# EAGLE design etch_a_sketc (EAGLE 9.6.2)
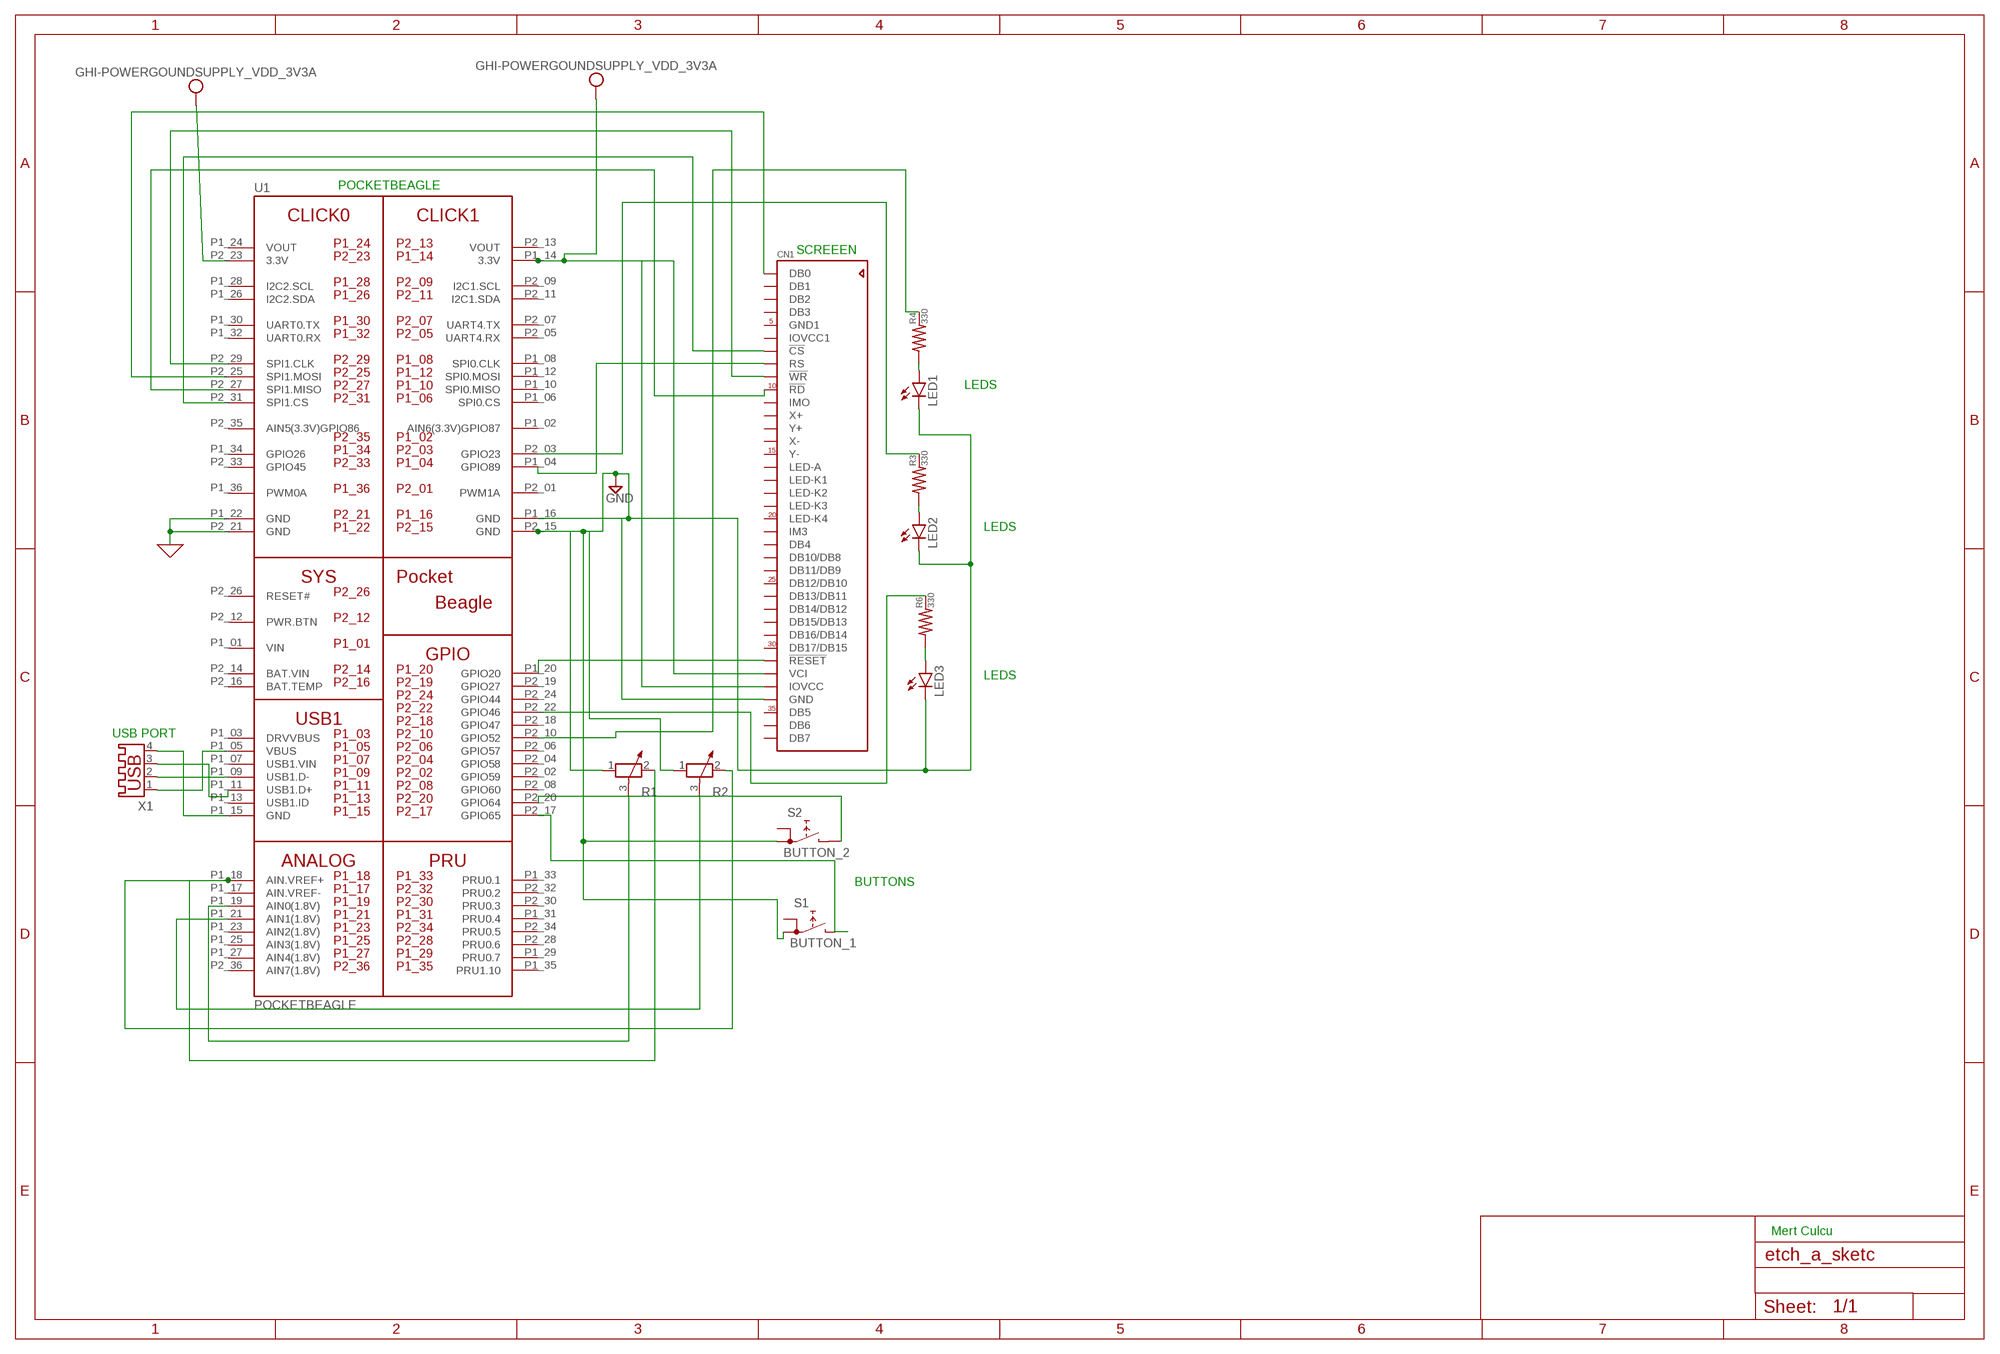
[diagram p0: schematic, sheet 1]

## Parts
CN1  ADAFRUIT_ILI9325_LCD1.0MM  [ADAFRUIT_ILI9325_28INCH_TS]
LED1  LED_BLUE5MM  [LED5MM]
LED2  LED_GREEN5MM  [LED5MM]
LED3  LED_RED5MM  [LED5MM]
R1  POTENTIOMETER_PT-10  [PT-10]
R2  POTENTIOMETER_2PT-10  [PT-10]
R3  330  GHI-BASICCOMPONENTS_RESISTOR-(INCH)-0402  [GHI-BASICCOMPONENTS_0402]
R4  330  GHI-BASICCOMPONENTS_RESISTOR-(INCH)-0402  [GHI-BASICCOMPONENTS_0402]
R6  330  GHI-BASICCOMPONENTS_RESISTOR-(INCH)-0402  [GHI-BASICCOMPONENTS_0402]
S1  BUTTON_1  [RDT1034]
S2  BUTTON_2  [RDT1034]
U1  POCKETBEAGLE  [POCKETBEAGLE]
X1  USB_CONNECTOR  [USB-A003]

## Nets
0: U1.P1_22(GND) U1.P2_21(GND) ; supply symbol labelled GND
GND: CN1.34(GND) LED1.K(C) LED2.K(C) LED3.K(C) R1.1 R2.1 S1.A1 S2.A1 U1.P1_16(GND) U1.P2_15(GND)
N$3: CN1.7(!CS) U1.P2_31(SPI1.CS)
N$4: CN1.8(RS) U1.P1_04(GPIO89)
N$5: CN1.9(!WR) U1.P2_29(SPI1.CLK)
N$6: CN1.10(!RD) U1.P2_27(SPI1.MISO)
N$7: CN1.1(DB0) U1.P2_25(SPI1.MOSI)
N$8: CN1.31(!RESET) U1.P1_20(GPIO20)
N$10: U1.P1_09(USB1.D-) X1.2
N$11: R1.2 R2.2 U1.P1_18(AIN.VREF+)
N$12: R1.3 U1.P1_19(AIN0(1.8V))
N$13: R2.3 U1.P1_21(AIN1(1.8V))
N$14: LED1.A R4.1
N$15: S2.B U1.P2_20(GPIO64)
N$16: S1.B U1.P2_17(GPIO65)
N$17: LED2.A R3.1
N$18: LED3.A R6.1
N$19: U1.P1_05(VBUS) X1.1
N$20: U1.P1_11(USB1.D+) X1.3
N$21: U1.P1_15(GND) X1.4
N$23: R6.2 U1.P2_22(GPIO46)
N$24: R3.2 U1.P2_03(GPIO23)
N$25: R4.2 U1.P2_10(GPIO52)
VDD_3V3A: CN1.32(VCI) CN1.33(IOVCC) U1.P1_14(3.3V) U1.P2_23(3.3V) ; supply symbol labelled GHI-POWERGOUNDSUPPLY_VDD_3V3A
Unconnected: CN1.2(DB1) CN1.3(DB2) CN1.4(DB3) CN1.11(IMO) CN1.12(X+) CN1.13(Y+) CN1.14(X-) CN1.15(Y-) CN1.16(LED-A) CN1.17(LED-K1) CN1.18(LED-K2) CN1.19(LED-K3) CN1.20(LED-K4) CN1.21(IM3) CN1.22(DB4) CN1.23(DB10/DB8) CN1.24(DB11/DB9) CN1.25(DB12/DB10) CN1.26(DB13/DB11) CN1.27(DB14/DB12) CN1.28(DB15/DB13) CN1.29(DB16/DB14) CN1.30(DB17/DB15) CN1.35(DB5) CN1.36(DB6) CN1.37(DB7) S1.A S2.A U1.P1_02(AIN6(3.3V)GPIO87) U1.P1_03(DRVVBUS) U1.P1_06(SPI0.CS) U1.P1_07(USB1.VIN) U1.P1_08(SPI0.CLK) U1.P1_10(SPI0.MISO) U1.P1_12(SPI0.MOSI) U1.P1_13(USB1.ID) U1.P1_17(AIN.VREF-) U1.P1_23(AIN2(1.8V)) U1.P1_25(AIN3(1.8V)) U1.P1_26(I2C2.SDA) U1.P1_27(AIN4(1.8V)) U1.P1_28(I2C2.SCL) U1.P1_29(PRU0.7) U1.P1_30(UART0.TX) U1.P1_31(PRU0.4) U1.P1_32(UART0.RX) U1.P1_33(PRU0.1) U1.P1_34(GPIO26) U1.P1_35(PRU1.10) U1.P1_36(PWM0A) U1.P2_01(PWM1A) U1.P2_02(GPIO59) U1.P2_04(GPIO58) U1.P2_05(UART4.RX) U1.P2_06(GPIO57) U1.P2_07(UART4.TX) U1.P2_08(GPIO60) U1.P2_09(I2C1.SCL) U1.P2_11(I2C1.SDA) U1.P2_12(PWR.BTN) U1.P2_16(BAT.TEMP) U1.P2_18(GPIO47) U1.P2_19(GPIO27) U1.P2_24(GPIO44) U1.P2_26(RESET#) U1.P2_28(PRU0.6) U1.P2_30(PRU0.3) U1.P2_32(PRU0.2) U1.P2_33(GPIO45) U1.P2_34(PRU0.5) U1.P2_35(AIN5(3.3V)GPIO86) U1.P2_36(AIN7(1.8V))

## Notes on the sheet
- POCKETBEAGLE
- SCREEEN
- LEDS
- LEDS
- LEDS
- USB PORT
- BUTTONS
- Mert Culcu

## Power pins joined to a net without a drawn wire
BAT.VIN: U1.P2_14(BAT.VIN)
GND1: CN1.5(GND1)
IOVCC1: CN1.6(IOVCC1)
VIN: U1.P1_01(VIN)
VOUT: U1.P1_24(VOUT) U1.P2_13(VOUT)

## Library data of the parts
CN1 = etch_a_sketch:ADAFRUIT_ILI9325_LCD: 2.8" ILI9325-based TFT LCD w/Integrated Touch Screen
LED1 = etch_a_sketch:LED_BLUE: LED OSRAM: - CHIPLED LG R971, LG N971, LY N971, LG Q971, LY Q971, LO R971, LY R971 LH N974, LH R974 LS Q976, LO Q976, LY Q976 LO Q996 - Hyper CHIPLED LW Q18S LB Q993, LB Q99A, LB R99A - SideLED LS A670, LO A670, LY A670, LG A670, LP A670 LB A673, LV A673, LT A673, LW A673 LH A674 LY A675 LS A676, LA A676, LO A676, LY A676, LW A676 LS A679, LY A679, LG A679 - Hyper Micro SIDELED® LS Y876, LA Y876, LO Y876, LY Y876 LT Y87S - SmartLED LW L88C, LW L88S LB L89C, LB L89S, LG L890 LS L89K, LO L89K, LY L89K LS L896, LA L896, LO L896, LY L896 - TOPLED LS T670, LO T670, LY T670, LG T670, LP T670 LSG T670, LSP T670, LSY T670, LOP T670, LYG T670 LG T671, LOG T671, LSG T671 LB T673, LV T673, LT T673, LW T673 LH T674 LS T676, LA T676, LO T676, LY T676, LB T676, LH T676, LSB T676, LW T676 LB T67C, LV T67C, LT T67C, LS T67K, LO T67K, LY T67K, LW E67C LS E67B, LA E67B, LO E67B, LY E67B, LB E67C, LV E67C, LT E67C LW T67C LS T679, LY T679, LG T679 LS T770, LO T770, LY T770, LG T770, LP T770 LB T773, LV T773, LT T773, LW T773 LH T774 LS E675, LA E675, LY E675, LS T675 LS T776, LA T776, LO T776, LY T776, LB T776 LHGB T686 LT T68C, LB T68C - Hyper Mini TOPLED® LB M676 - Mini TOPLED Santana® LG M470 LS M47K, LO M47K, LY M47K Source: http://www.osram.convergy.de LUXEON: - LUMILED® LXK2-PW12-R00, LXK2-PW12-S00, LXK2-PW14-U00, LXK2-PW14-V00 LXK2-PM12-R00, LXK2-PM12-S00, LXK2-PM14-U00 LXK2-PE12-Q00, LXK2-PE12-R00, LXK2-PE12-S00, LXK2-PE14-T00, LXK2-PE14-U00 LXK2-PB12-K00, LXK2-PB12-L00, LXK2-PB12-M00, LXK2-PB14-N00, LXK2-PB14-P00, LXK2-PB14-Q00 LXK2-PR12-L00, LXK2-PR12-M00, LXK2-PR14-Q00, LXK2-PR14-R00 LXK2-PD12-Q00, LXK2-PD12-R00, LXK2-PD12-S00 LXK2-PH12-R00, LXK2-PH12-S00 LXK2-PL12-P00, LXK2-PL12-Q00, LXK2-PL12-R00 Source: www.luxeon.com KINGBRIGHT: KA-3528ASYC Source: www.kingbright.com
LED2 = etch_a_sketch:LED_GREEN: LED OSRAM: - CHIPLED LG R971, LG N971, LY N971, LG Q971, LY Q971, LO R971, LY R971 LH N974, LH R974 LS Q976, LO Q976, LY Q976 LO Q996 - Hyper CHIPLED LW Q18S LB Q993, LB Q99A, LB R99A - SideLED LS A670, LO A670, LY A670, LG A670, LP A670 LB A673, LV A673, LT A673, LW A673 LH A674 LY A675 LS A676, LA A676, LO A676, LY A676, LW A676 LS A679, LY A679, LG A679 - Hyper Micro SIDELED® LS Y876, LA Y876, LO Y876, LY Y876 LT Y87S - SmartLED LW L88C, LW L88S LB L89C, LB L89S, LG L890 LS L89K, LO L89K, LY L89K LS L896, LA L896, LO L896, LY L896 - TOPLED LS T670, LO T670, LY T670, LG T670, LP T670 LSG T670, LSP T670, LSY T670, LOP T670, LYG T670 LG T671, LOG T671, LSG T671 LB T673, LV T673, LT T673, LW T673 LH T674 LS T676, LA T676, LO T676, LY T676, LB T676, LH T676, LSB T676, LW T676 LB T67C, LV T67C, LT T67C, LS T67K, LO T67K, LY T67K, LW E67C LS E67B, LA E67B, LO E67B, LY E67B, LB E67C, LV E67C, LT E67C LW T67C LS T679, LY T679, LG T679 LS T770, LO T770, LY T770, LG T770, LP T770 LB T773, LV T773, LT T773, LW T773 LH T774 LS E675, LA E675, LY E675, LS T675 LS T776, LA T776, LO T776, LY T776, LB T776 LHGB T686 LT T68C, LB T68C - Hyper Mini TOPLED® LB M676 - Mini TOPLED Santana® LG M470 LS M47K, LO M47K, LY M47K Source: http://www.osram.convergy.de LUXEON: - LUMILED® LXK2-PW12-R00, LXK2-PW12-S00, LXK2-PW14-U00, LXK2-PW14-V00 LXK2-PM12-R00, LXK2-PM12-S00, LXK2-PM14-U00 LXK2-PE12-Q00, LXK2-PE12-R00, LXK2-PE12-S00, LXK2-PE14-T00, LXK2-PE14-U00 LXK2-PB12-K00, LXK2-PB12-L00, LXK2-PB12-M00, LXK2-PB14-N00, LXK2-PB14-P00, LXK2-PB14-Q00 LXK2-PR12-L00, LXK2-PR12-M00, LXK2-PR14-Q00, LXK2-PR14-R00 LXK2-PD12-Q00, LXK2-PD12-R00, LXK2-PD12-S00 LXK2-PH12-R00, LXK2-PH12-S00 LXK2-PL12-P00, LXK2-PL12-Q00, LXK2-PL12-R00 Source: www.luxeon.com KINGBRIGHT: KA-3528ASYC Source: www.kingbright.com
LED3 = etch_a_sketch:LED_RED: LED OSRAM: - CHIPLED LG R971, LG N971, LY N971, LG Q971, LY Q971, LO R971, LY R971 LH N974, LH R974 LS Q976, LO Q976, LY Q976 LO Q996 - Hyper CHIPLED LW Q18S LB Q993, LB Q99A, LB R99A - SideLED LS A670, LO A670, LY A670, LG A670, LP A670 LB A673, LV A673, LT A673, LW A673 LH A674 LY A675 LS A676, LA A676, LO A676, LY A676, LW A676 LS A679, LY A679, LG A679 - Hyper Micro SIDELED® LS Y876, LA Y876, LO Y876, LY Y876 LT Y87S - SmartLED LW L88C, LW L88S LB L89C, LB L89S, LG L890 LS L89K, LO L89K, LY L89K LS L896, LA L896, LO L896, LY L896 - TOPLED LS T670, LO T670, LY T670, LG T670, LP T670 LSG T670, LSP T670, LSY T670, LOP T670, LYG T670 LG T671, LOG T671, LSG T671 LB T673, LV T673, LT T673, LW T673 LH T674 LS T676, LA T676, LO T676, LY T676, LB T676, LH T676, LSB T676, LW T676 LB T67C, LV T67C, LT T67C, LS T67K, LO T67K, LY T67K, LW E67C LS E67B, LA E67B, LO E67B, LY E67B, LB E67C, LV E67C, LT E67C LW T67C LS T679, LY T679, LG T679 LS T770, LO T770, LY T770, LG T770, LP T770 LB T773, LV T773, LT T773, LW T773 LH T774 LS E675, LA E675, LY E675, LS T675 LS T776, LA T776, LO T776, LY T776, LB T776 LHGB T686 LT T68C, LB T68C - Hyper Mini TOPLED® LB M676 - Mini TOPLED Santana® LG M470 LS M47K, LO M47K, LY M47K Source: http://www.osram.convergy.de LUXEON: - LUMILED® LXK2-PW12-R00, LXK2-PW12-S00, LXK2-PW14-U00, LXK2-PW14-V00 LXK2-PM12-R00, LXK2-PM12-S00, LXK2-PM14-U00 LXK2-PE12-Q00, LXK2-PE12-R00, LXK2-PE12-S00, LXK2-PE14-T00, LXK2-PE14-U00 LXK2-PB12-K00, LXK2-PB12-L00, LXK2-PB12-M00, LXK2-PB14-N00, LXK2-PB14-P00, LXK2-PB14-Q00 LXK2-PR12-L00, LXK2-PR12-M00, LXK2-PR14-Q00, LXK2-PR14-R00 LXK2-PD12-Q00, LXK2-PD12-R00, LXK2-PD12-S00 LXK2-PH12-R00, LXK2-PH12-S00 LXK2-PL12-P00, LXK2-PL12-Q00, LXK2-PL12-R00 Source: www.luxeon.com KINGBRIGHT: KA-3528ASYC Source: www.kingbright.com
R1 = etch_a_sketch:POTENTIOMETER_: Potentiometer; SPICEMODEL: POT; SPICEPREFIX: X
R2 = etch_a_sketch:POTENTIOMETER_2: Potentiometer; SPICEMODEL: POT; SPICEPREFIX: X
R3 R4 R6 = etch_a_sketch:GHI-BASICCOMPONENTS_RESISTOR-(INCH)-: Basic SMD Resistors
S1 = etch_a_sketch:BUTTON_1: PUSH SWITCH www.radiohm.com
S2 = etch_a_sketch:BUTTON_2: PUSH SWITCH www.radiohm.com
U1 = etch_a_sketch:POCKETBEAGLE
X1 = etch_a_sketch:USB_CONNECTOR: USB connector; OC_FARNELL: unknown; OC_NEWARK: unknown

## Board
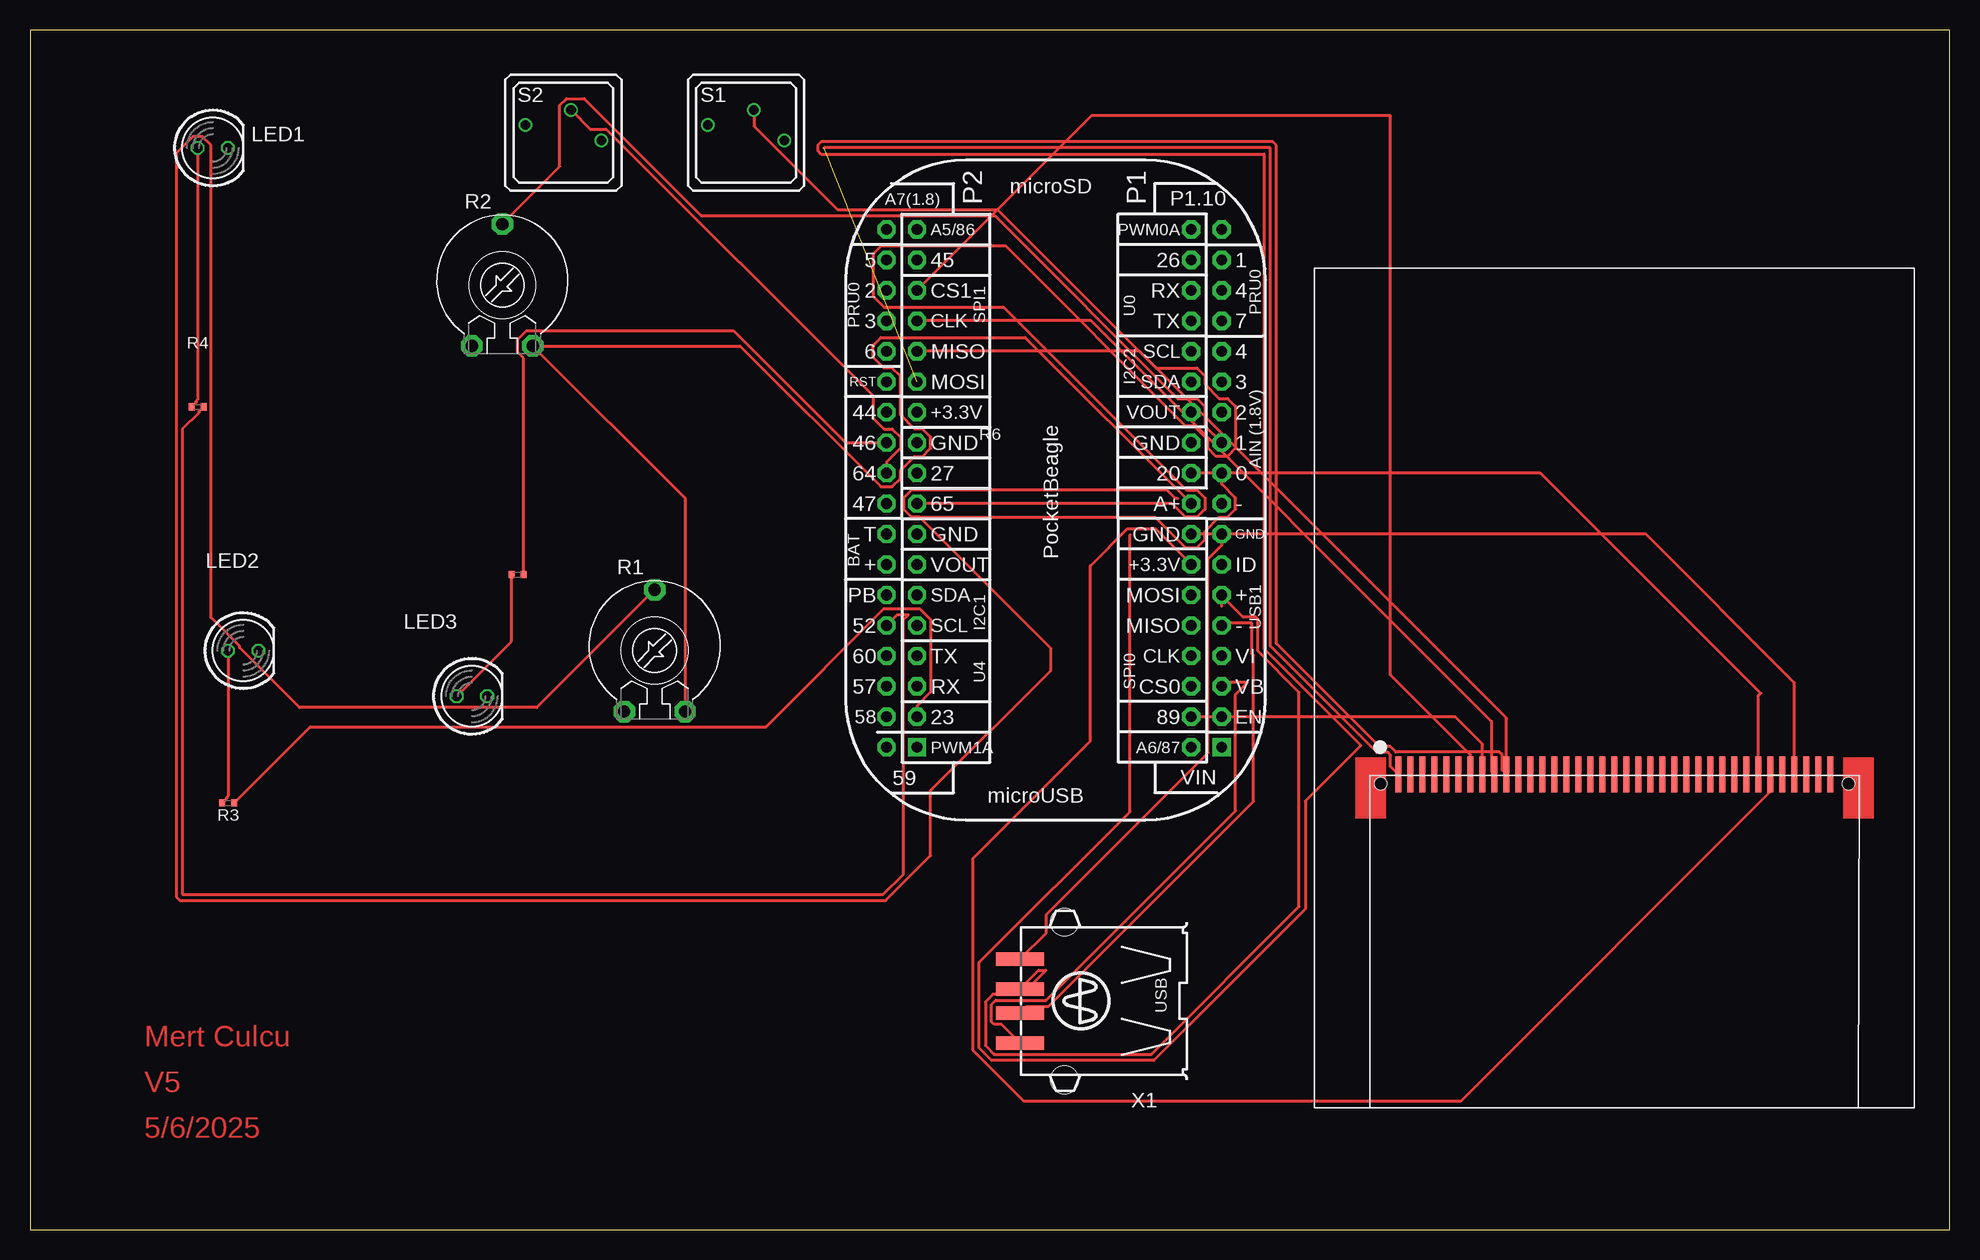
[diagram p1: board, top side]
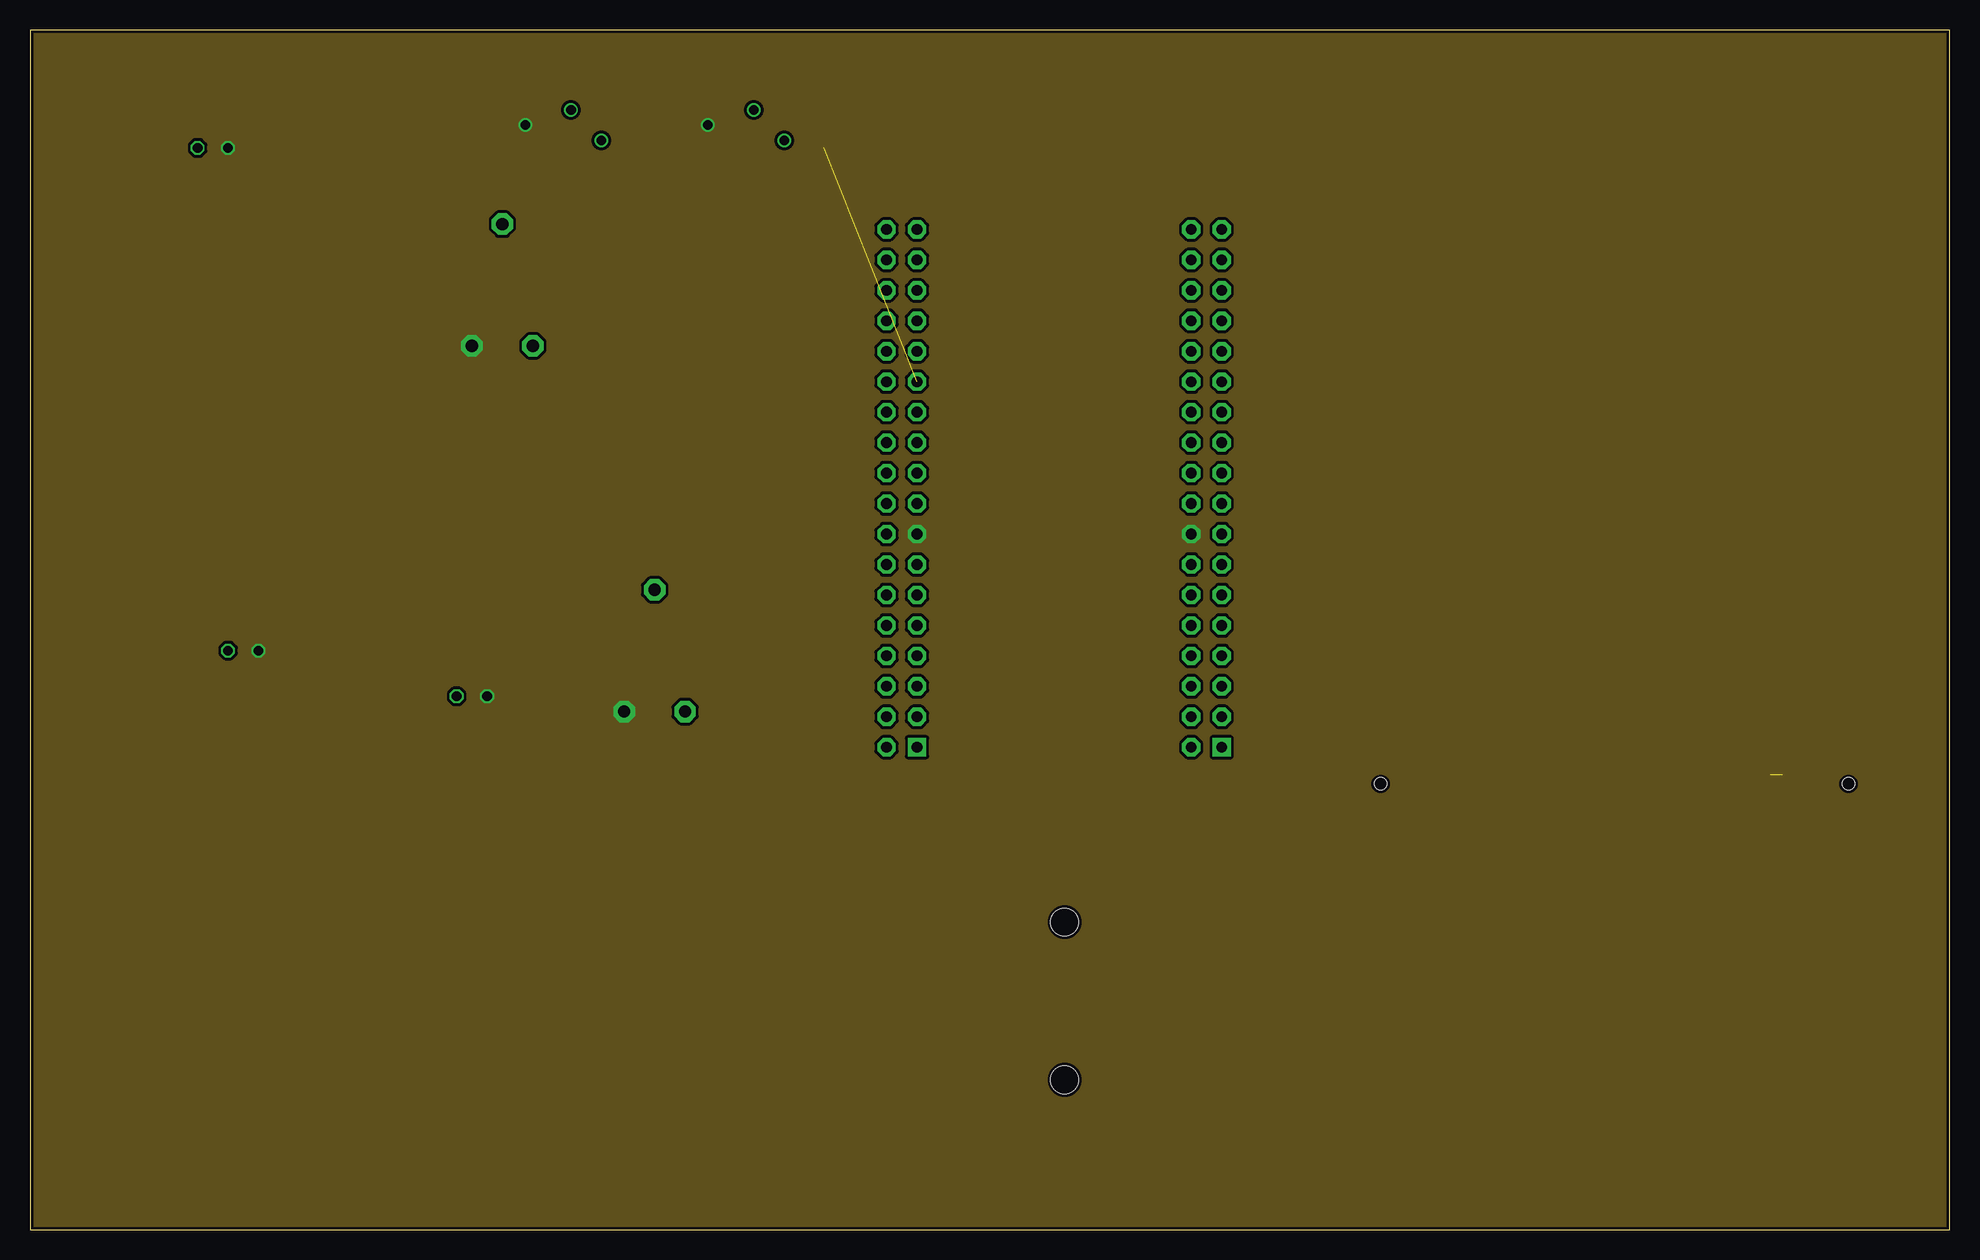
[diagram p2: board, inner layer Route2]
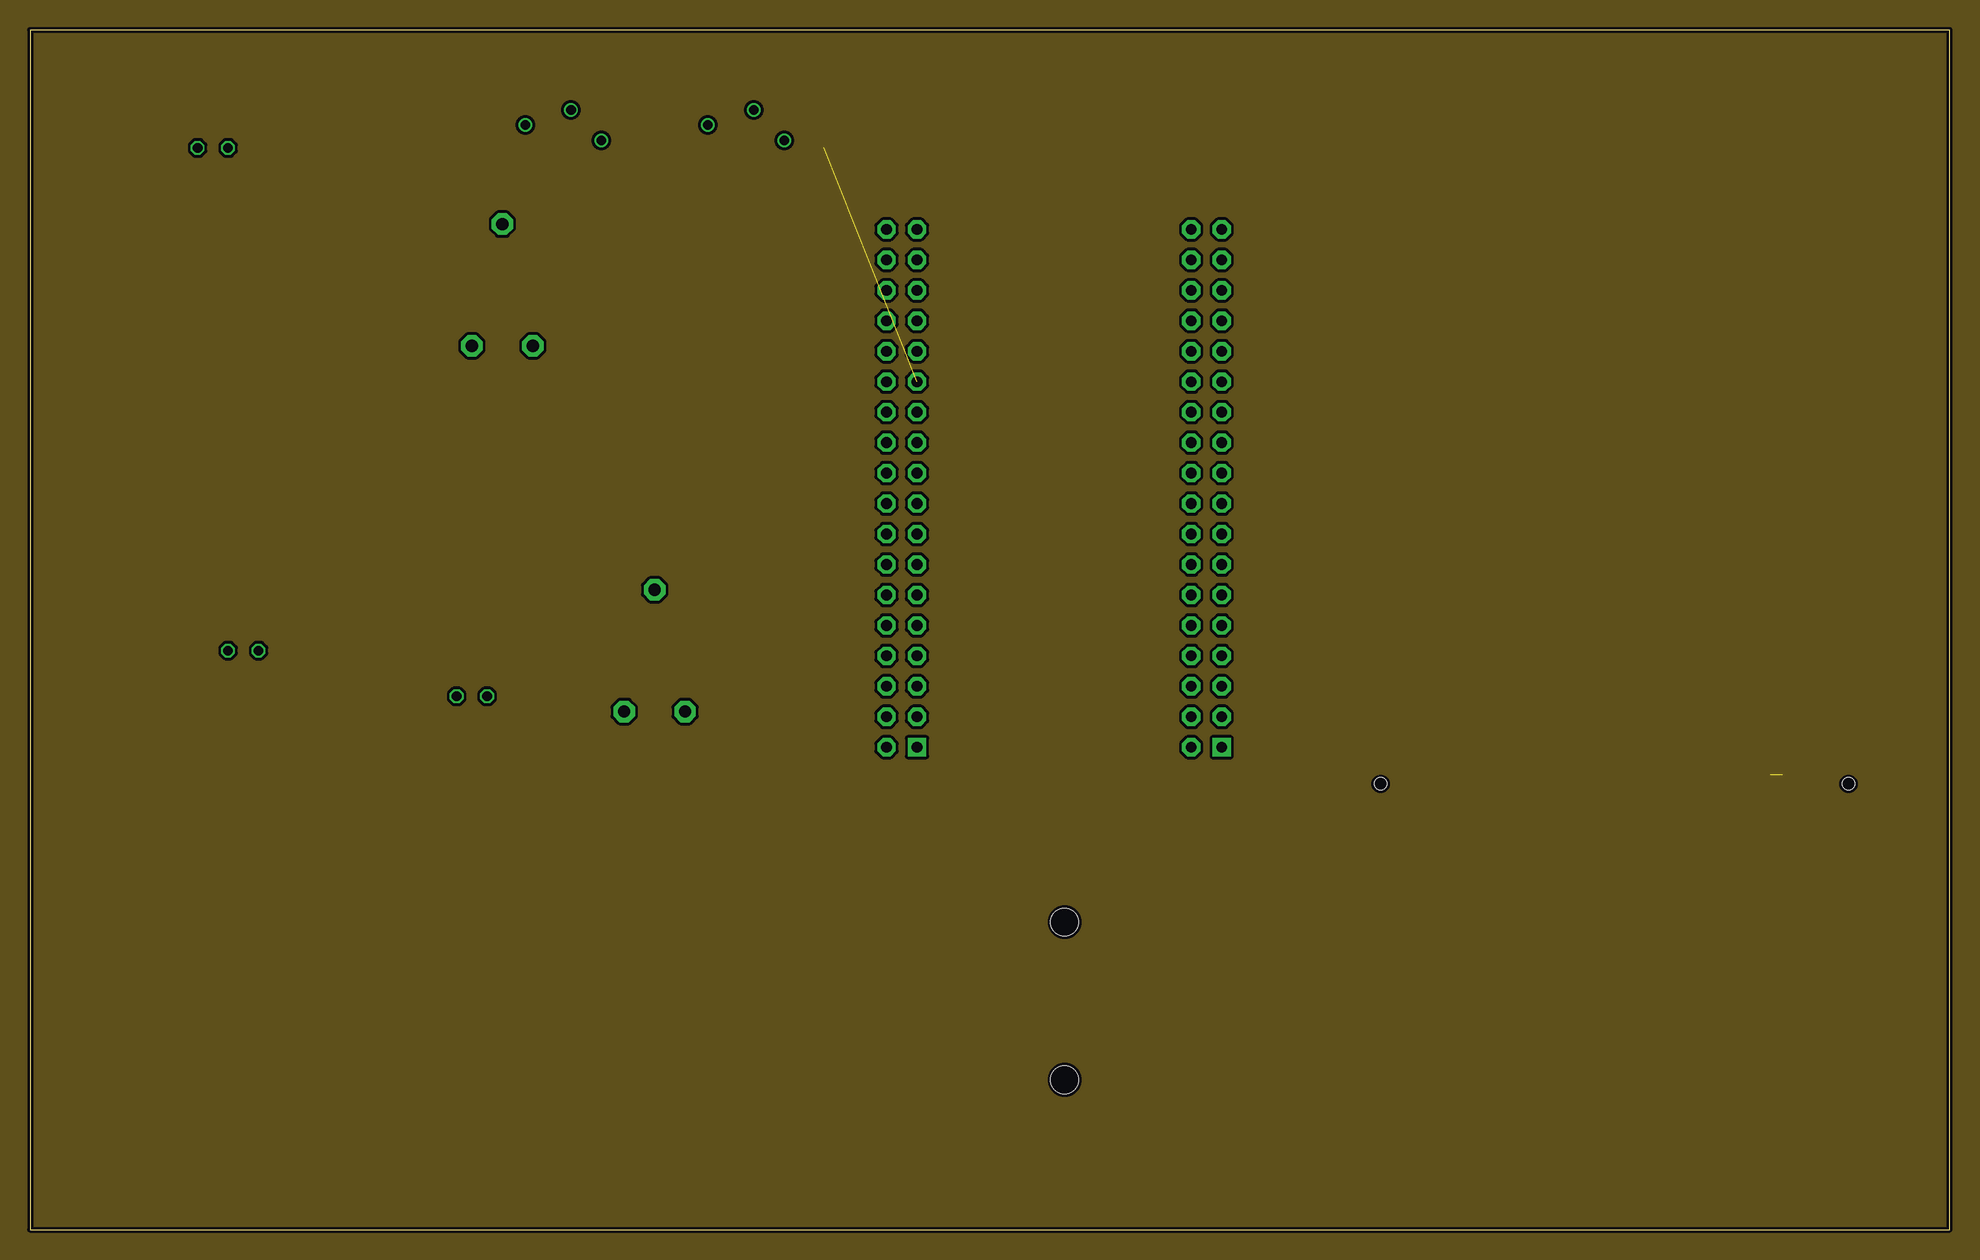
[diagram p3: board, inner layer Route15]
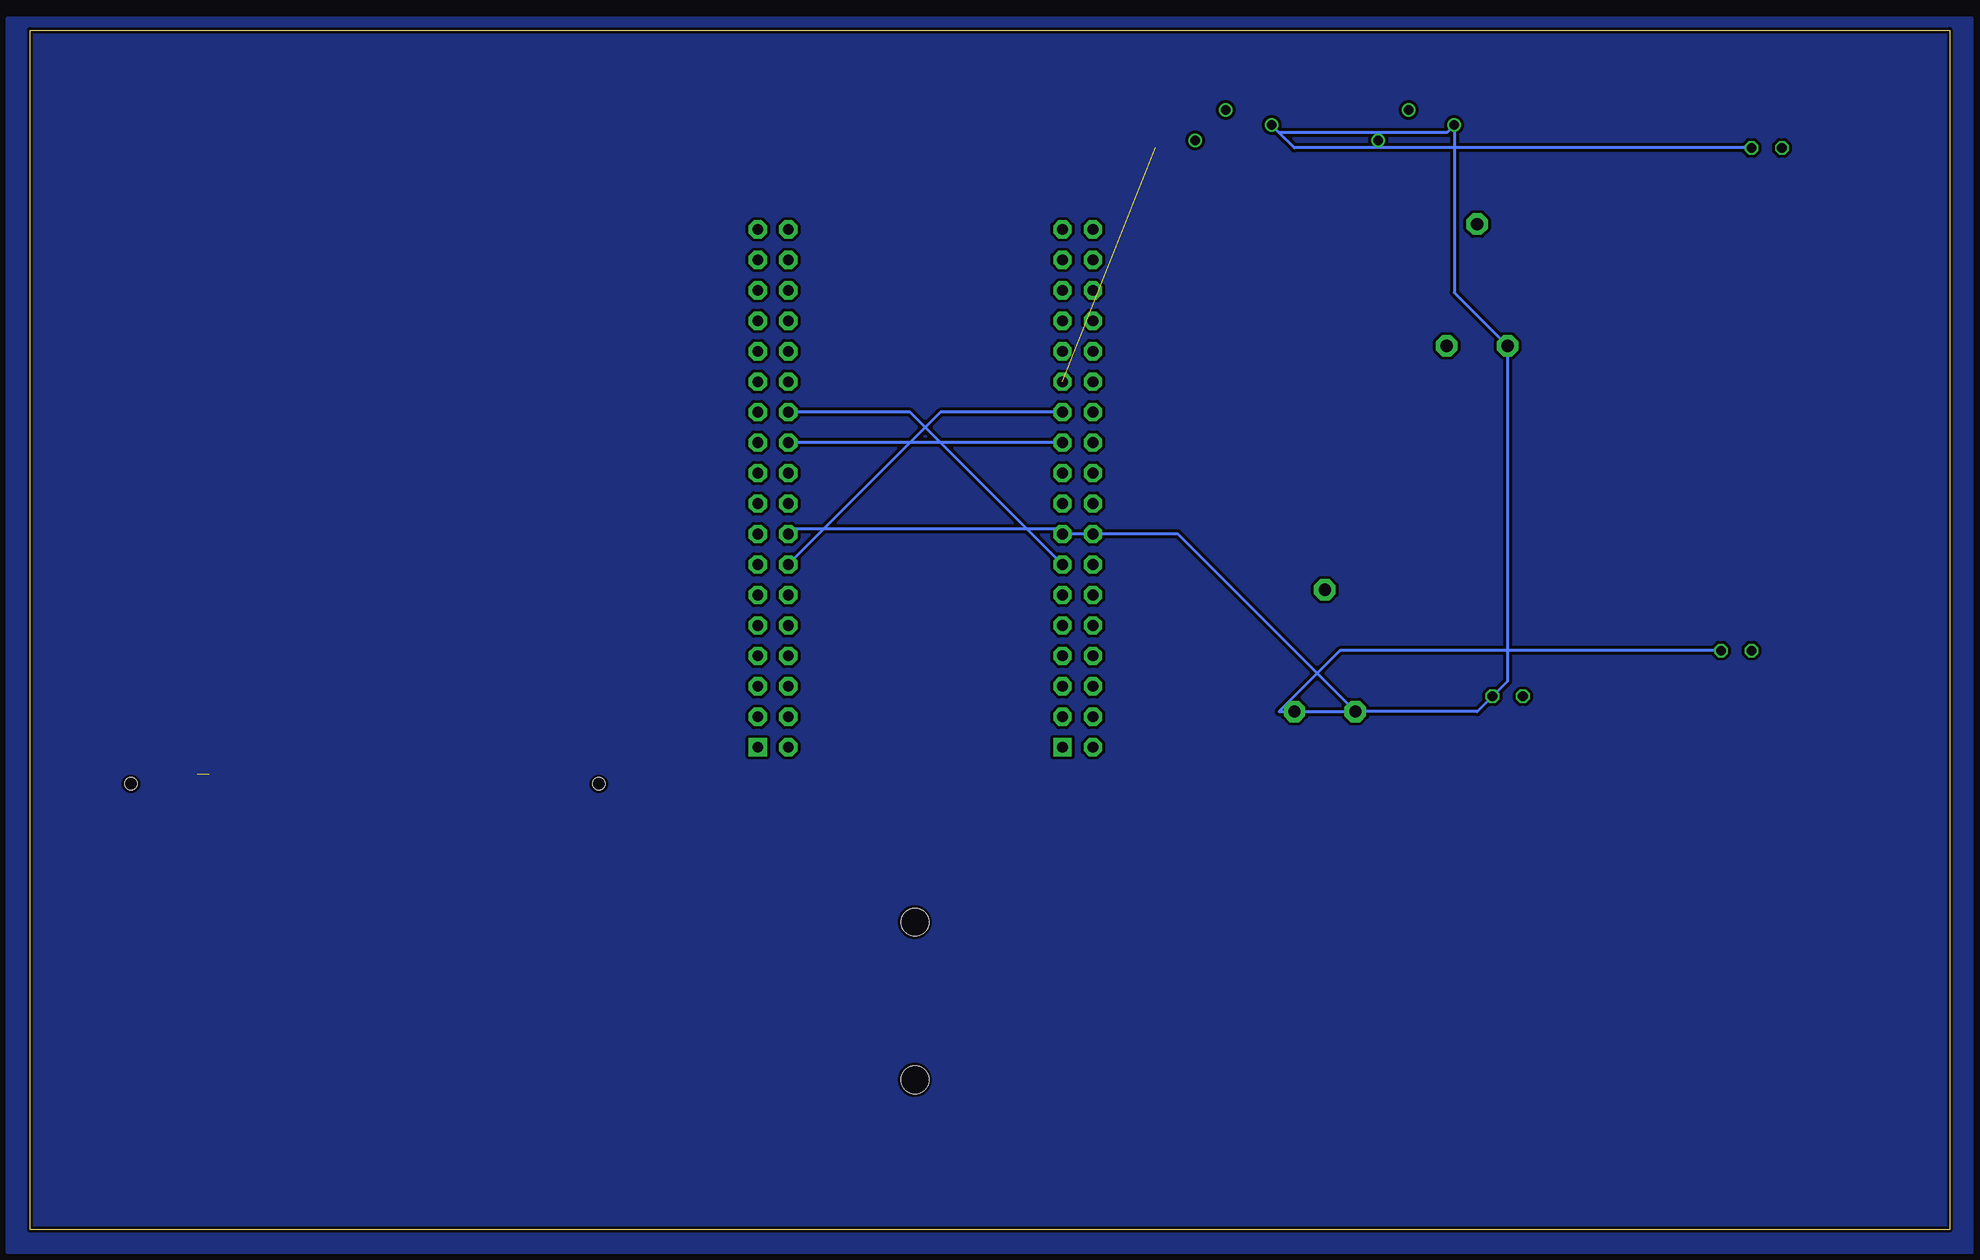
[diagram p4: board, bottom side, seen from below]

Size 160 x 100 mm. Coordinates in mm from the lower left corner, seen from the top.
Outline: 0,0 160,0 160,100 0,100 0,0
Copper layers (1*2*15*16): Top 0.035mm / dielectric 0.23mm / Route2 0.035mm / dielectric 0.93mm / Route15 0.035mm / dielectric 0.23mm / Bottom 0.035mm
Design rules "ENGI301_4lyr": minimum track width 10mil, minimum drill 12mil, track to track 10mil, track to pad 10mil, pad to pad 10mil, via to via 10mil, smd to smd 10mil, copper to edge 10mil, drill to drill 12mil, minimum pad ring 6mil, minimum via ring 6mil, stop-mask expansion 3mil, vias tented up to drill 25mil, thermal gap 10mil

### Footprints (pad centres in the part's own frame; a part is rotated, then mirrored left to right if it is on the bottom)
ADAFRUIT_ILI9325_28INCH_TS = smd 0.5 x 3: 1 -18,27.77; 2 -17,27.77; 3 -16,27.77; 4 -15,27.77; 5 -14,27.77; 6 -13,27.77; 7 -12,27.77; 8 -11,27.77; 9 -10,27.77; 10 -9,27.77; 11 -8,27.77; 12 -7,27.77; 13 -6,27.77; 14 -5,27.77; 15 -4,27.77; 16 -3,27.77; 17 -2,27.77; 18 -1,27.77; 19 0,27.77; 20 1,27.77; 21 2,27.77; 22 3,27.77; 23 4,27.77; 24 5,27.77; 25 6,27.77; 26 7,27.77; 27 8,27.77; 28 9,27.77; 29 10,27.77; 30 11,27.77; 31 12,27.77; 32 13,27.77; 33 14,27.77; 34 15,27.77; 35 16,27.77; 36 17,27.77; 37 18,27.77 | hole 1: -19.5,27; 19.5,27
LED5MM = drill 0.813 octagon: A -1.27,0; K 1.27,0
PT-10 = drill 1.016 pad 1.778 octagon: 1 -2.54,-5.08; 2 2.54,-5.08; 3 0,5.08
GHI-BASICCOMPONENTS_0402 = smd 0.5 x 0.6: 1 -0.5,0; 2 0.5,0
RDT1034 = drill 0.8: A 3.175,-0.635; A1 -3.175,0.635; B 0.65,1.9
POCKETBEAGLE = drill 0.889 pad 1.524 square: P1_01 5.91,3.53; P2_01 5.91,28.93 | drill 0.889 pad 1.524 octagon: P1_02 5.91,6.07; P1_03 8.45,3.53; P1_04 8.45,6.07; P1_05 10.99,3.53; P1_06 10.99,6.07; P1_07 13.53,3.53; P1_08 13.53,6.07; P1_09 16.07,3.53; P1_10 16.07,6.07; P1_11 18.61,3.53; P1_12 18.61,6.07; P1_13 21.15,3.53; P1_14 21.15,6.07; P1_15 23.69,3.53; P1_16 23.69,6.07; P1_17 26.23,3.53; P1_18 26.23,6.07; P1_19 28.77,3.53; P1_20 28.77,6.07; P1_21 31.31,3.53; P1_22 31.31,6.07; P1_23 33.85,3.53; P1_24 33.85,6.07; P1_25 36.39,3.53; P1_26 36.39,6.07; P1_27 38.93,3.53; P1_28 38.93,6.07; P1_29 41.47,3.53; P1_30 41.47,6.07; P1_31 44.01,3.53; P1_32 44.01,6.07; P1_33 46.55,3.53; P1_34 46.55,6.07; P1_35 49.09,3.53; P1_36 49.09,6.07; P2_02 5.91,31.47; P2_03 8.45,28.93; P2_04 8.45,31.47; P2_05 10.99,28.93; P2_06 10.99,31.47; P2_07 13.53,28.93; P2_08 13.53,31.47; P2_09 16.07,28.93; P2_10 16.07,31.47; P2_11 18.61,28.93; P2_12 18.61,31.47; P2_13 21.15,28.93; P2_14 21.15,31.47; P2_15 23.69,28.93; P2_16 23.69,31.47; P2_17 26.23,28.93; P2_18 26.23,31.47; P2_19 28.77,28.93; P2_20 28.77,31.47; P2_21 31.31,28.93; P2_22 31.31,31.47; P2_23 33.85,28.93; P2_24 33.85,31.47; P2_25 36.39,28.93; P2_26 36.39,31.47; P2_27 38.93,28.93; P2_28 38.93,31.47; P2_29 41.47,28.93; P2_30 41.47,31.47; P2_31 44.01,28.93; P2_32 44.01,31.47; P2_33 46.55,28.93; P2_34 46.55,31.47; P2_35 49.09,28.93; P2_36 49.09,31.47
USB-A003 = smd 1.12 x 4: 1 -3.5,14; 2 -1,14; 3 1,14; 4 3.5,14 | hole 2.3: -6.57,10.28; 6.57,10.28

### Placement (x,y rotation side)
CN1  132.08,10.16 0 top
LED1  15.24,90.17 0 top
LED2  17.78,48.26 0 top
LED3  36.83,44.45 0 top
R1  52.07,48.26 0 top
R2  39.37,78.74 0 top
R3  16.51,35.56 0 top
R4  13.97,68.58 0 top
R6  40.64,54.61 0 top
S1  59.69,91.44 0 top
S2  44.45,91.44 0 top
U1  102.87,34.29 90 top
X1  96.52,19.05 90 top

### Tracks (layer width: path | path; a pad name or v marks a point on that pad's centre or on a via)
0
  Bottom 0.254: U1.P2_21 U1.P1_22
BOTTOM
  pour Bottom (no thermals): -1.91,0 -1.91,100.97 161.93,100.97 161.93,-1.91 -1.91,-1.91
GND
  Top 0.254: CN1.34 147.08,45.58 134.68,57.98 U1.P1_16
  Bottom 0.254: LED1.K 54.61,90.17 55.88,91.44 | 55.88,91.44 S1.A1 | LED2.K 50.8,48.26 55.88,43.18 R1.1 | R1.1 64.33,57.98 73.66,57.98 | 73.66,57.98 U1.P2_15 | U1.P1_16 96.52,58.26 96.52,58.42 74.1,58.42 73.66,57.98 | R1.1 39.37,43.18 LED3.K 36.83,45.72 R2.1 41.27,78.11 S2.A1 41.91,91.44 55.88,91.44
  pour Route2 (no thermals): -2.54,101.6 162.56,101.6 162.56,-2.54 -2.54,-2.54
N$3
  Top 0.254: CN1.7 120.08,39.58 113.41,46.25 113.41,92.84 88.48,92.84 U1.P2_31
N$4
  Top 0.254: CN1.8 121.08,40.47 118.81,42.74 U1.P1_04
N$5
  Top 0.254: CN1.9 121.83,38.18 121.83,42.38 88.44,75.76 U1.P2_29
N$6
  Top 0.254: 91.69,57.91 91.69,34.82 79.12,22.25 79.12,15.13 80.15,14.1 93.69,14.1 106.3,26.71 106.3,35.72 110.94,40.35 102.87,48.42 102.87,89.66 65.96,89.66 65.66,89.96 65.66,90.38 65.96,90.68 103.59,90.68 103.89,90.38 103.89,48.84 112.47,40.26 113.4,40.26 113.85,39.81 122.49,39.81 122.71,39.59 122.71,38.3 CN1.10 123.08,42.63 92.49,73.22 U1.P2_27
N$7  (1 unrouted)
  Top 0.254: CN1.1 113.41,38.6 113.41,39.53 113.19,39.75 112.26,39.75 103.38,48.63 103.38,90.17 66.17,90.17
N$8
  Top 0.254: CN1.31 144.08,44.51 144.27,44.7 125.92,63.06 U1.P1_20
N$10
  Top 0.254: X1.2 83.07,18.6 84.89,18.6 101.98,35.69 101.98,47.87 101.85,48 101.85,50.55 99.53,50.55 U1.P1_09
N$11
  Top 0.254: U1.P1_18 82.96,74.36 70.93,74.36 70.26,73.69 70.26,72.75 71.18,71.82 71.87,71.82 72.54,71.15 72.54,67.92 73.72,66.74 74.41,66.74 75.08,66.07 75.08,65.13 74.41,64.46 73.72,64.46 72.54,63.28 72.54,62.59 71.87,61.92 70.93,61.92 59.18,73.66 R2.2 54.61,60.96 R1.2
N$12
  Top 0.254: R1.3 42.23,43.5 22.47,43.5 17.46,48.51 17.46,48.65 15.1,51.01 15.1,90.38 14.36,91.12 13.58,91.12 12.19,89.73 12.19,27.73 12.49,27.43 71.33,27.43 75.08,31.18 75.08,36.6 85.09,46.61 85.09,48.45 74.16,59.38 | 74.16,59.38 73.47,59.38 72.8,60.05 72.8,60.99 73.47,61.66 94.76,61.66 95.48,60.95 95.66,60.95 | 74.16,59.38 93.79,59.38 96.33,56.84 97.27,56.84 97.94,57.51 97.94,58.2 99.12,59.38 99.81,59.38 100.48,60.05 100.48,60.99 99.34,62.14 U1.P1_19
N$13
  Top 0.254: U1.P1_21 97.94,67 97.94,68.61 97.27,69.28 95.66,69.28 80.42,84.52 55.96,84.52 46.2,94.28 44.71,94.28 44.16,93.73 44.16,88.61 R2.3
N$14
  Top 0.254: LED1.A 13.97,69.17 13.84,69.04 13.84,68.95 R4.1
N$15
  Top 0.254: S2.B 46.69,91.75 48.02,91.75 70.26,69.5 70.26,67.67 71.18,66.74 71.87,66.74 72.54,66.07 72.54,65.13 71.4,63.98 U1.P2_20
N$16
  Top 0.254: S1.B 60.34,92 67.31,85.03 80.63,85.03 93.83,71.82 97.27,71.82 97.94,71.15 97.94,70.46 99.12,69.28 99.81,69.28 100.48,68.61 100.48,65.13 99.81,64.46 98.87,64.46 98.2,65.13 98.2,65.82 97.02,67 96.33,67 81.34,81.98 70.93,81.98 70.26,81.31 70.26,77.83 71.18,76.9 81.14,76.9 96.38,61.66 97.27,61.66 97.94,60.99 97.94,60.05 97.27,59.38 96.33,59.38 95.18,60.52 U1.P2_17
N$17
  Top 0.254: LED2.A 16.51,36.15 16.38,36.02 16.38,35.93 R3.1
N$18
  Top 0.254: LED3.A 40.14,49.03 R6.1
N$19
  Top 0.254: X1.1 80.96,17.11 80.36,17.11 80.14,17.33 80.14,18.77 80.48,19.11 84.68,19.11 100.48,34.91 100.48,44.6 101.47,45.59 99.65,45.59 U1.P1_05
N$20
  Top 0.254: X1.3 84.08,21.61 84.68,21.61 82.69,19.62 80.27,19.62 79.63,18.98 79.63,15.34 80.36,14.61 93.48,14.61 105.79,26.92 105.79,44.78 102.36,48.21 102.36,50.88 102.19,51.05 101.12,51.05 99.34,52.83 | 99.34,51.98 99.34,52.83 | 99.34,52.83 U1.P1_11
N$21
  Top 0.254: X1.4 84.71,24.74 84.71,26.25 98.2,39.74 98.2,55.91 99.34,57.06 U1.P1_15
N$23
  Top 0.254: U1.P2_22 67.96,65.6 58.63,74.93 41.38,74.93 40.64,74.19 40.64,73.13 41.14,72.63 R6.2
N$24
  Top 0.254: R3.2 23.36,41.91 61.33,41.91 71.18,51.76 74.16,51.76 75.08,50.83 75.08,44.81 73.94,43.66 U1.P2_03
N$25
  Top 0.254: R4.2 14.1,68.21 14.1,68.12 12.7,66.72 12.7,27.94 71.12,27.94 72.8,29.62 72.8,50.83 73.21,51.25 72.29,51.25 U1.P2_10
VDD
  pour Route15 (no thermals): -5.08,104.14 165.1,104.14 165.1,-5.08 -5.08,-5.08
VDD_3V3A  (1 unrouted)
  Top 0.254: CN1.32 145.08,36.5 119.28,10.7 82.84,10.7 78.61,14.92 78.61,30.94 88.39,40.72 88.39,55.33 91.48,58.42 93.82,58.42 U1.P1_14
  Bottom 0.254: U1.P2_23 84.1,68.14 U1.P1_14
VOUT
  Bottom 0.254: U1.P2_13 86.64,68.14 U1.P1_24

### Text on the board
Top: Mert Culcu | V5 | 5/6/2025